# EAGLE schematic imu_finger (EAGLE 9.1.3)
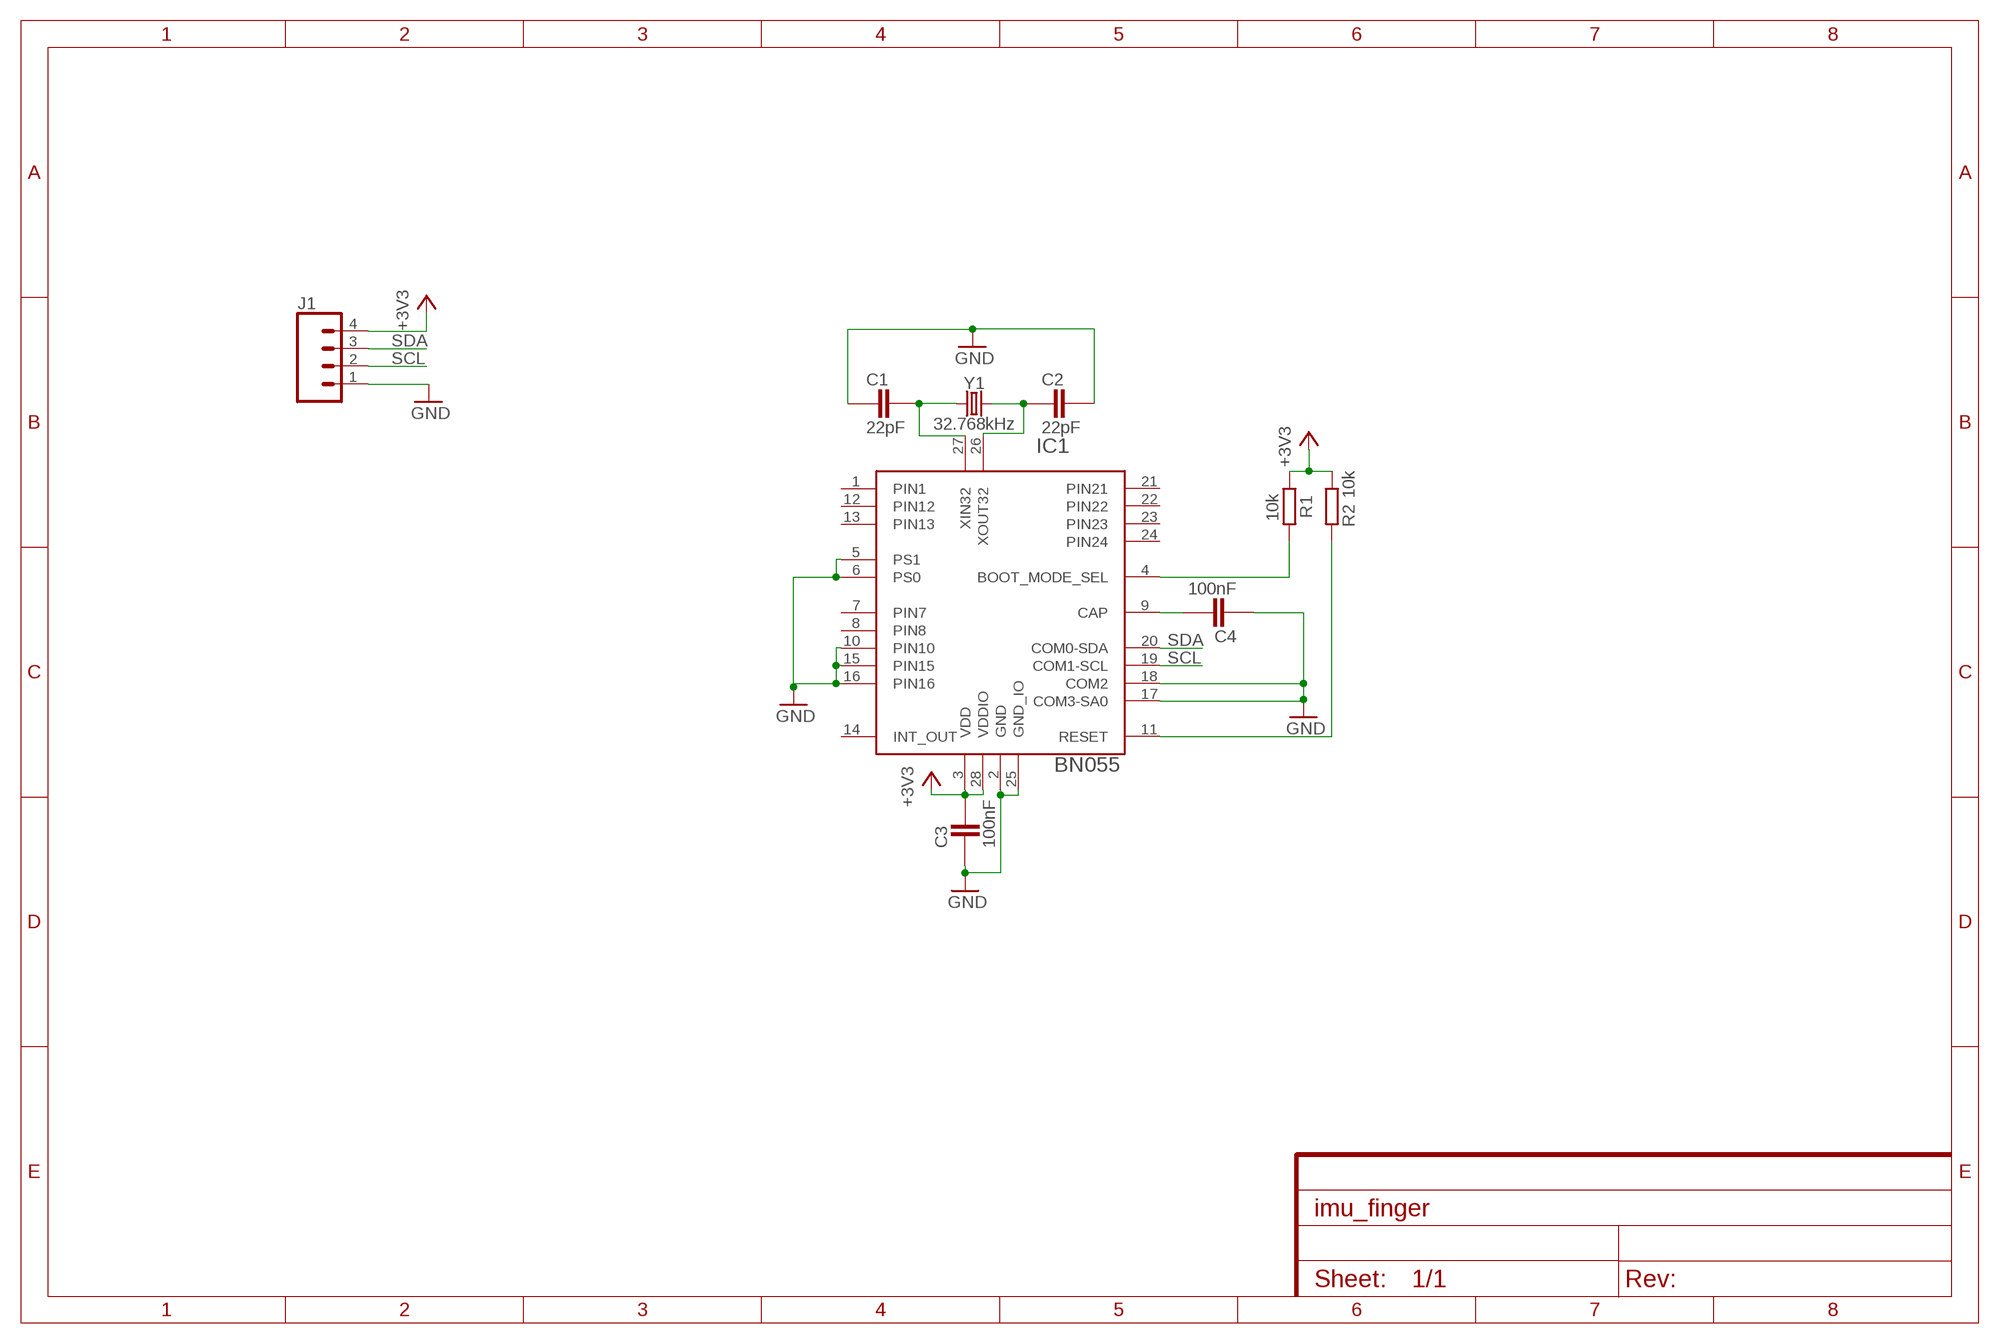
[diagram p0: schematic, sheet 1]

## Parts
C1  22pF  CAPACITOR_0603  [CAPC1608X92N]
C2  22pF  CAPACITOR_0603  [CAPC1608X92N]
C3  100nF  CAPACITOR_0603  [CAPC1608X92N]
C4  100nF  CAPACITOR_0603  [CAPC1608X92N]
IC1  BN055  1658_BNO055  [LGA-28_3.80X5.20/0.5]
J1  CONN_04SMD2  [1X04_1MM_RA]
R1  10k  RESISTOR_0603  [RESC1608X55N]
R2  10k  RESISTOR_0603  [RESC1608X55N]
Y1  32.768kHz  CRYSTAL-32.768KHZSMD-3.2X1.5  [CRYSTAL-SMD-3.2X1.5MM]

## Nets
+3V3: C3.2 IC1.3(VDD) IC1.28(VDDIO) J1.4 R1.1 R2.1
GND: C1.1 C2.2 C3.1 C4.1 IC1.2(GND) IC1.5(PS1) IC1.6(PS0) IC1.10(PIN10) IC1.15(PIN15) IC1.16(PIN16) IC1.17(COM3-SA0) IC1.18(COM2) IC1.25(GND_IO) J1.1
N$1: IC1.11(RESET) R2.2
N$2: IC1.4(BOOT_MODE_SEL) R1.2
N$3: C4.2 IC1.9(CAP)
N$4: C2.1 IC1.26(XOUT32) Y1.P$2
N$5: C1.2 IC1.27(XIN32) Y1.P$1
SCL: IC1.19(COM1-SCL) J1.2
SDA: IC1.20(COM0-SDA) J1.3
Unconnected: IC1.1(PIN1) IC1.7(PIN7) IC1.8(PIN8) IC1.12(PIN12) IC1.13(PIN13) IC1.14(INT_OUT) IC1.21(PIN21) IC1.22(PIN22) IC1.23(PIN23) IC1.24(PIN24)

## Library data of the parts
C1-C4 = ipc-7351-capacitor:CAPACITOR_
IC1 = BNO055:1658_BNO055: BN055 Intelligent 9-axis absolute orientation sensor; PART_NUMBER: BNO055
J1 = SparkFun-Connectors:CONN_04: Multi connection point. Often used as Generic Header-pin footprint for 0.1 inch spaced/style header connections On any of the 0.1 inch spaced packages, you can populate with these: Break Away Headers - Straight <https://www.sparkfun.com/products/116> (PRT-00116) Break Away Male Headers - Right Angle <https://www.sparkfun.com/products/553> (PRT-00553) Female Headers <https://www.sparkfun.com/products/115> (PRT-00115) Break Away Headers - Machine Pin <https://www.sparkfun.com/products/117> (PRT-00117) Break Away Female Headers - Swiss Machine Pin <https://www.sparkfun.com/products/743> (PRT-00743) For SCREWTERMINALS and SPRING TERMINALS visit here: Screw Terimnals on SparkFun.com <https://www.sparkfun.com/search/results?term=Screw+Terminals> (5mm/3.5mm/2.54mm spacing) This device is also useful as a general connection point to wire up your design to another part of your project. Our various solder wires solder well into these plated through hole pads. Hook-Up Wire - Assortment (Stranded, 22 AWG) <https://www.sparkfun.com/products/11375> (PRT-11375) Hook-Up Wire - Assortment (Solid Core, 22 AWG) <https://www.sparkfun.com/products/11367> (PRT-11367) View the entire wire category on our website here <https://www.sparkfun.com/categories/141> Special notes: Molex polarized connector foot print use with SKU : PRT-08231 with associated crimp pins and housings. 1MM SMD Version SKU: PRT-10208; PROD_ID: CONN-10310; SF_ID: PRT-10208
R1 R2 = ipc-7351-resistor:RESISTOR_
Y1 = SparkFun-Clocks:CRYSTAL-32.768KHZ: 32.768kHz Crystal Frequency: 32.768kHz Frequency Stability: ±20ppm Load Capacitance: 12.5pF (PTH-2X6 & SMD-3.2X1.5), 6pF (SMD-2X6) SparkFun Products: SparkFun BigTime Watch Kit <https://www.sparkfun.com/products/11734> SparkFun nRF52832 Breakout <https://www.sparkfun.com/products/13990> SparkFun Real Time Clock Module <https://www.sparkfun.com/products/12708>; PROD_ID: XTAL-13062